# EAGLE schematic final_schematic (EAGLE 9.3.0)
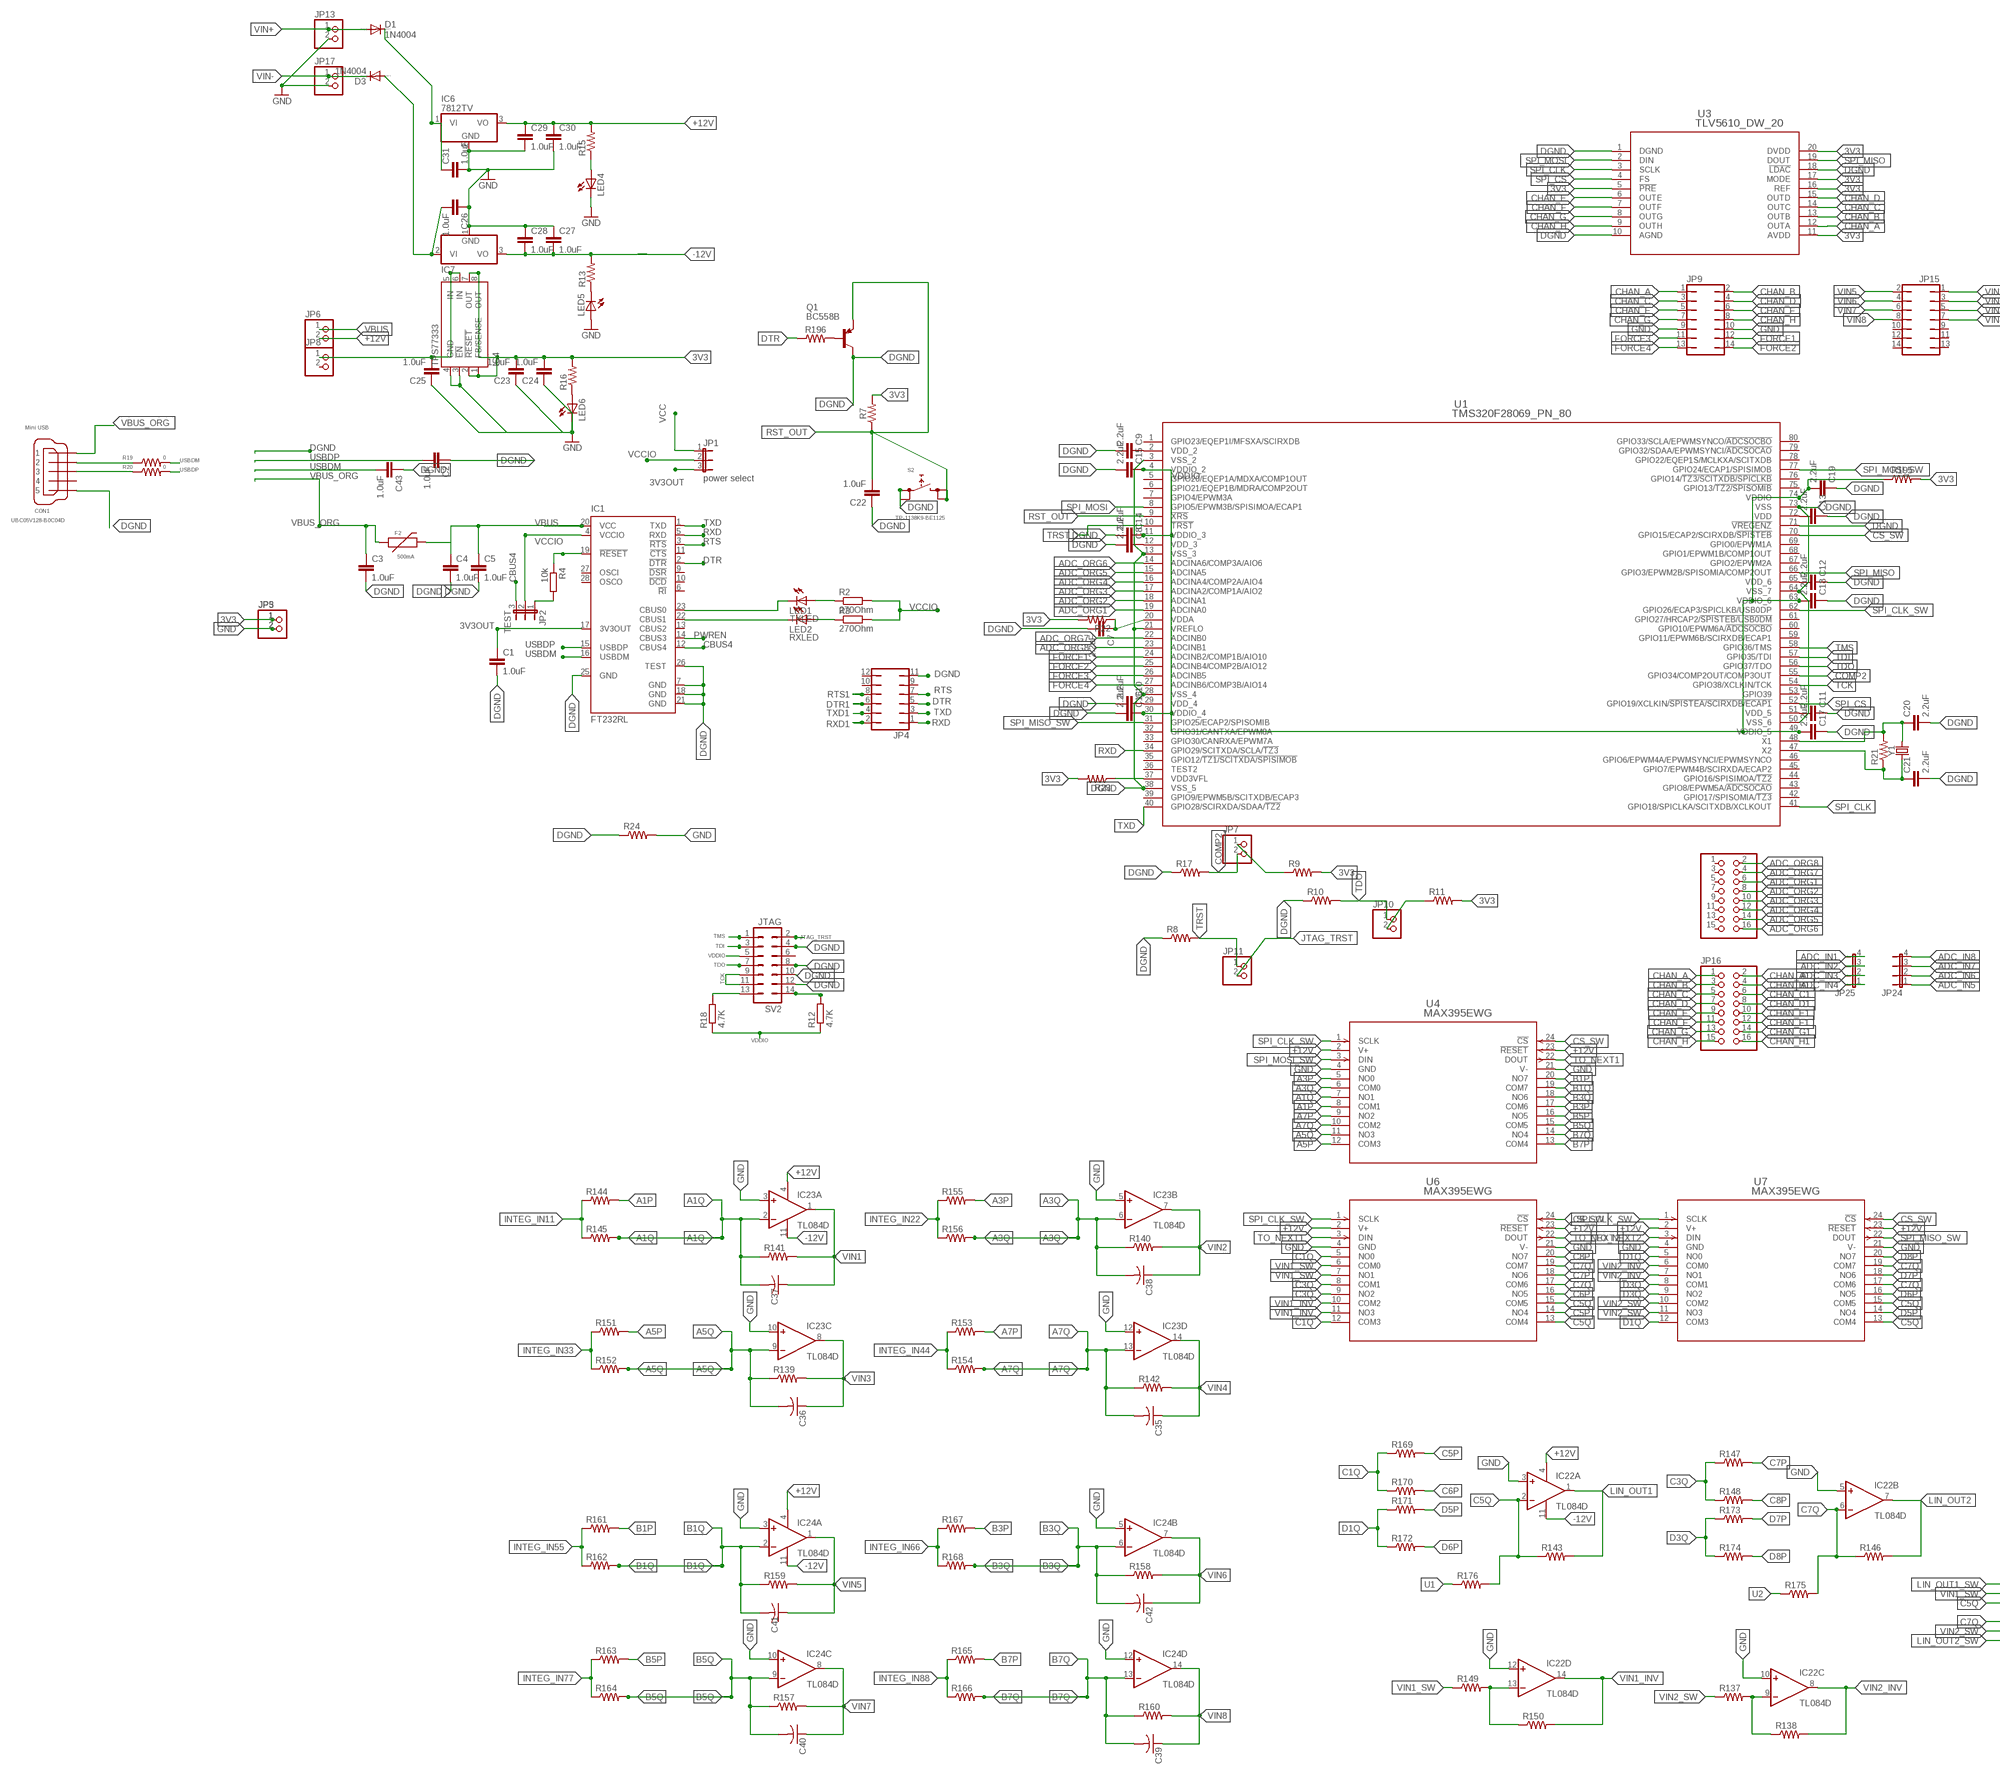
[diagram p0: schematic, sheet 1, part 1 of 3]
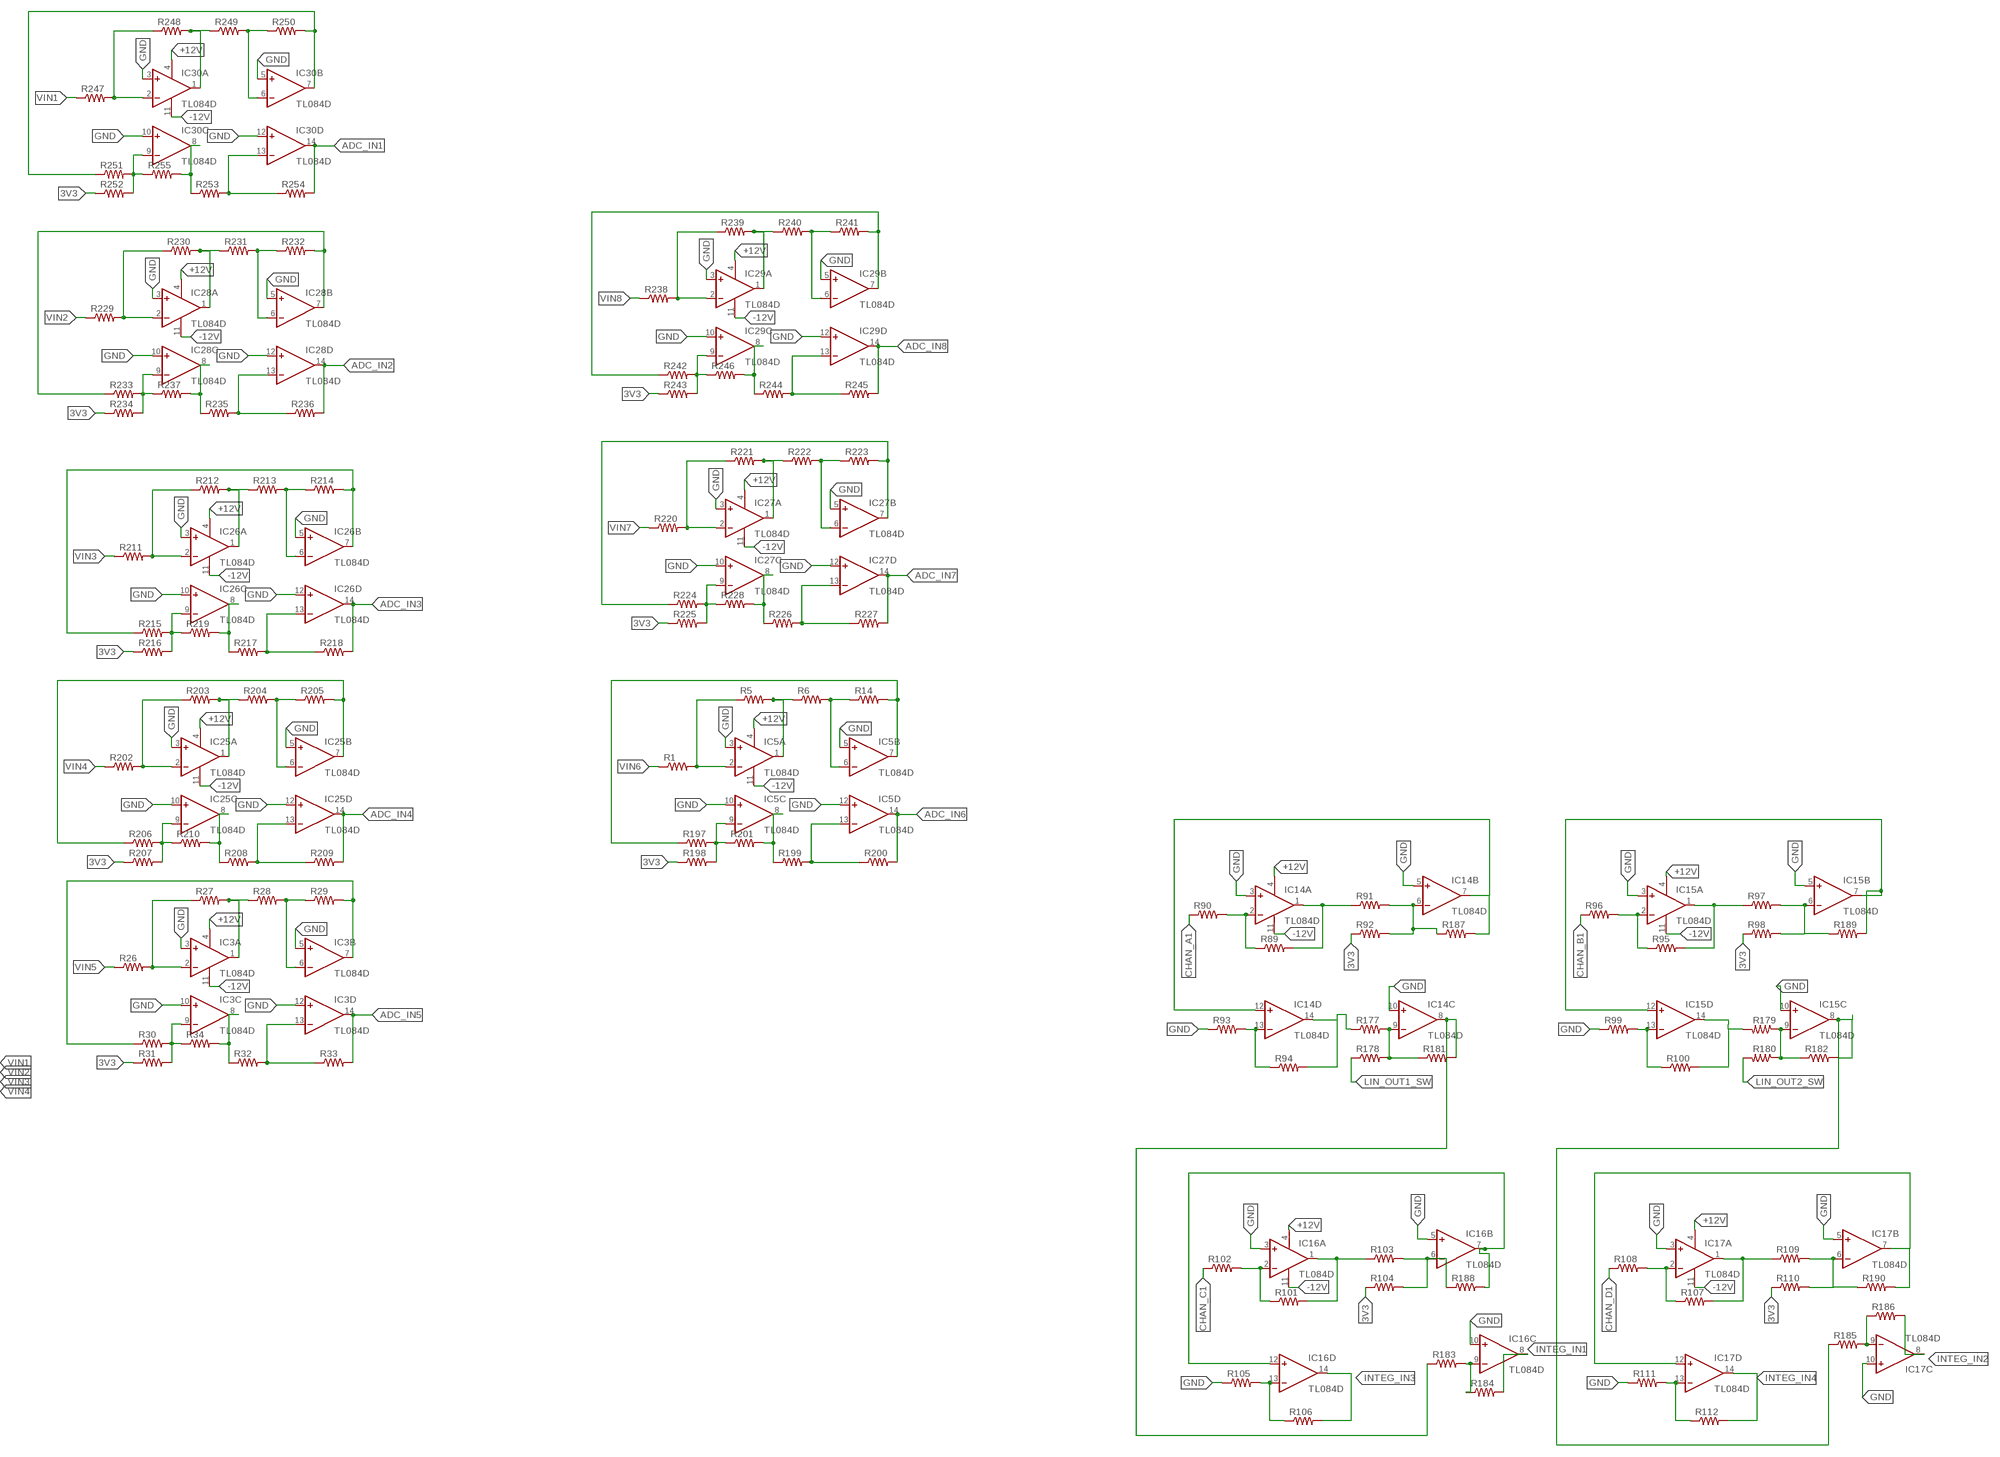
[diagram p1: schematic, sheet 1, part 2 of 3]
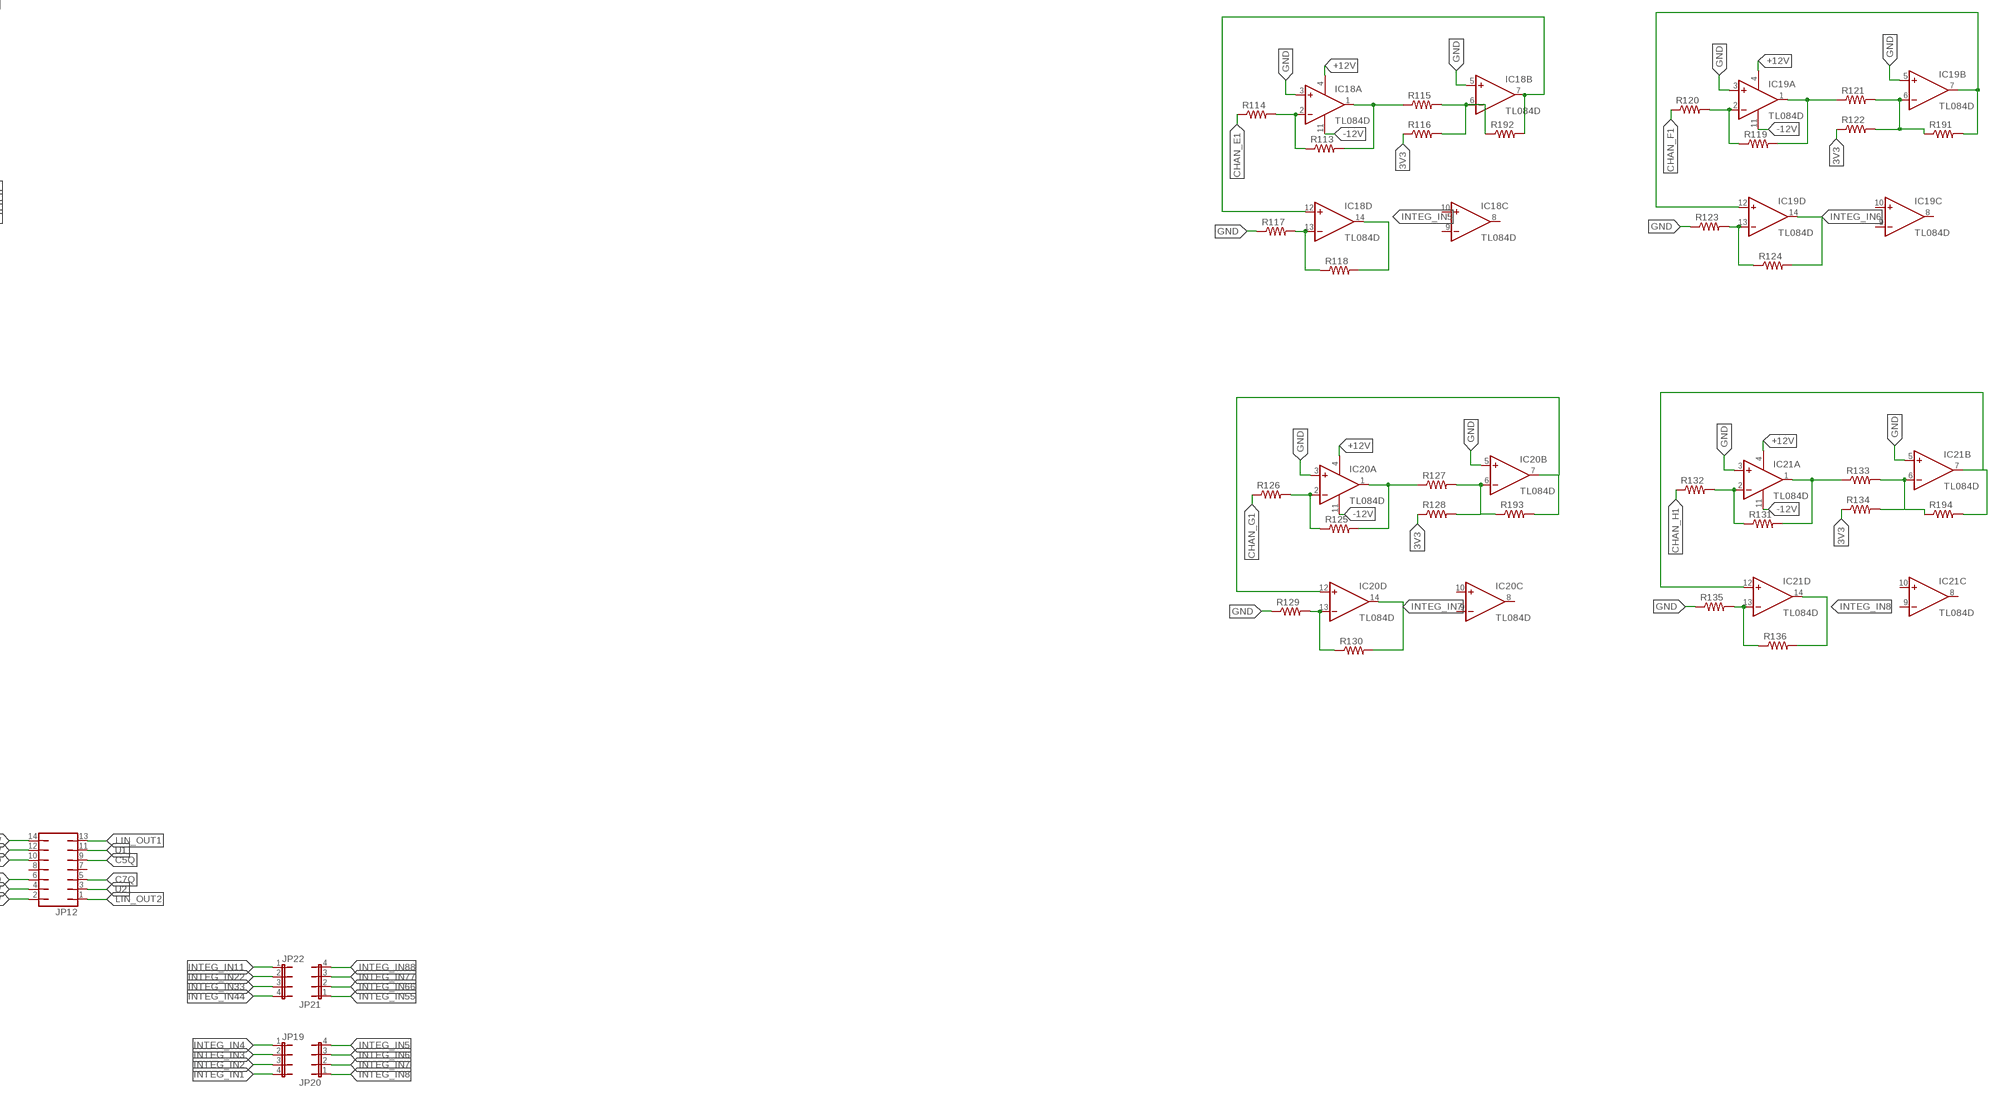
[diagram p2: schematic, sheet 1, part 3 of 3]

## Parts
C1  1.0uF  1.0UF-1206-50V-10%  [1206]
C2  1.0uF  1.0UF-1206-50V-10%  [1206]
C3  1.0uF  1.0UF-1206-50V-10%  [1206]
C4  1.0uF  1.0UF-1206-50V-10%  [1206]
C5  1.0uF  1.0UF-1206-50V-10%  [1206]
C7  2.2uF  2.2UF-1206-50V-10%  [1206]
C8  2.2uF  2.2UF-1206-50V-10%  [1206]
C9  2.2uF  2.2UF-1206-50V-10%  [1206]
C10  2.2uF  2.2UF-1206-50V-10%  [1206]
C11  2.2uF  2.2UF-1206-50V-10%  [1206]
C12  2.2uF  2.2UF-1206-50V-10%  [1206]
C13  2.2uF  2.2UF-1206-50V-10%  [1206]
C14  2.2uF  2.2UF-1206-50V-10%  [1206]
C15  2.2uF  2.2UF-1206-50V-10%  [1206]
C16  2.2uF  2.2UF-1206-50V-10%  [1206]
C17  2.2uF  2.2UF-1206-50V-10%  [1206]
C18  2.2uF  2.2UF-1206-50V-10%  [1206]
C19  2.2uF  2.2UF-1206-50V-10%  [1206]
C20  2.2uF  2.2UF-1206-50V-10%  [1206]
C21  2.2uF  2.2UF-1206-50V-10%  [1206]
C22  1.0uF  1.0UF-1206-50V-10%  [1206]
C23  1.0uF  1.0UF-1206-50V-10%  [1206]
C24  1.0uF  1.0UF-1206-50V-10%  [1206]
C25  1.0uF  1.0UF-1206-50V-10%  [1206]
C26  1.0uF  1.0UF-1206-50V-10%  [1206]
C27  1.0uF  1.0UF-1206-50V-10%  [1206]
C28  1.0uF  1.0UF-1206-50V-10%  [1206]
C29  1.0uF  1.0UF-1206-50V-10%  [1206]
C30  1.0uF  1.0UF-1206-50V-10%  [1206]
C31  1.0uF  1.0UF-1206-50V-10%  [1206]
C35  C-USC1206  [C1206]
C36  C-USC1206  [C1206]
C37  C-USC1206  [C1206]
C38  C-USC1206  [C1206]
C39  C-USC1206  [C1206]
C40  C-USC1206  [C1206]
C41  C-USC1206  [C1206]
C42  C-USC1206  [C1206]
C43  1.0uF  1.0UF-1206-50V-10%  [1206]
CON1  UBC05V128-B0C04D  MINI-USB-32005-201  [32005-201]
D1  1N4004  [DO41-10]
D3  1N4004  [DO41-10]
F2  500mA  PTCSMD  [PTC-1206]
IC1  FT232RL  [SSOP28]
IC3  TL084D  [SO14]
IC4  TPS77333  [DGK_S-PDSO-G8]
IC5  TL084D  [SO14]
IC6  7812TV  [TO220V]
IC7  7912T  [TO220H]
IC14  TL084D  [SO14]
IC15  TL084D  [SO14]
IC16  TL084D  [SO14]
IC17  TL084D  [SO14]
IC18  TL084D  [SO14]
IC19  TL084D  [SO14]
IC20  TL084D  [SO14]
IC21  TL084D  [SO14]
IC22  TL084D  [SO14]
IC23  TL084D  [SO14]
IC24  TL084D  [SO14]
IC25  TL084D  [SO14]
IC26  TL084D  [SO14]
IC27  TL084D  [SO14]
IC28  TL084D  [SO14]
IC29  TL084D  [SO14]
IC30  TL084D  [SO14]
JP1  power select  JP2E  [JP2]
JP2  TEST  JP2E  [JP2]
JP3  PINHD-1X2  [1X02]
JP4  JP6Q  [JP6Q]
JP5  PINHD-1X2  [1X02]
JP6  PINHD-1X2  [1X02]
JP7  PINHD-1X2  [1X02]
JP8  PINHD-1X2  [1X02]
JP9  JP7Q  [JP7Q]
JP10  PINHD-1X2  [1X02]
JP11  PINHD-1X2  [1X02]
JP12  JP7Q  [JP7Q]
JP13  PINHD-1X2  [1X02]
JP15  JP7Q  [JP7Q]
JP16  PINHD-2X8  [2X08]
JP17  PINHD-1X2  [1X02]
JP18  PINHD-2X8  [2X08]
JP19  JP4E  [JP4]
JP20  JP4E  [JP4]
JP21  JP4E  [JP4]
JP22  JP4E  [JP4]
JP24  JP4E  [JP4]
JP25  JP4E  [JP4]
LED1  TXLED  LEDCHIPLED_1206  [CHIPLED_1206]
LED2  RXLED  LEDCHIPLED_1206  [CHIPLED_1206]
LED4  LED3MM  [LED3MM]
LED5  LED3MM  [LED3MM]
LED6  LED3MM  [LED3MM]
Q1  BC558B  [TO92-EBC]
R1  R-US_R1206  [R1206]
R2  270Ohm  R-EU_M1206  [M1206]
R3  270Ohm  R-EU_M1206  [M1206]
R4  10k  R-EU_M1206  [M1206]
R5  R-US_R1206  [R1206]
R6  R-US_R1206  [R1206]
R7  RESISTOR1206  [1206]
R8  R-US_R1206  [R1206]
R9  R-US_R1206  [R1206]
R10  R-US_R1206  [R1206]
R11  R-US_R1206  [R1206]
R12  4.7K  R-EU_M1206  [M1206]
R13  R-US_R1206  [R1206]
R14  R-US_R1206  [R1206]
R15  R-US_R1206  [R1206]
R16  R-US_R1206  [R1206]
R17  R-US_R1206  [R1206]
R18  4.7K  R-EU_M1206  [M1206]
R19  0  R-US_R1206  [R1206]
R20  0  R-US_R1206W  [R1206W]
R21  R-US_R1206  [R1206]
R22  R-US_R1206  [R1206]
R23  R-US_R1206  [R1206]
R24  R-US_0207/7  [0207/7]
R26  R-US_R1206  [R1206]
R27  R-US_R1206  [R1206]
R28  R-US_R1206  [R1206]
R29  R-US_R1206  [R1206]
R30  R-US_R1206  [R1206]
R31  R-US_R1206  [R1206]
R32  R-US_R1206  [R1206]
R33  R-US_R1206  [R1206]
R34  R-US_R1206  [R1206]
R89  R-US_R1206  [R1206]
R90  R-US_R1206  [R1206]
R91  R-US_R1206  [R1206]
R92  R-US_R1206  [R1206]
R93  R-US_R1206  [R1206]
R94  R-US_R1206  [R1206]
R95  R-US_R1206  [R1206]
R96  R-US_R1206  [R1206]
R97  R-US_R1206  [R1206]
R98  R-US_R1206  [R1206]
R99  R-US_R1206  [R1206]
R100  R-US_R1206  [R1206]
R101  R-US_R1206  [R1206]
R102  R-US_R1206  [R1206]
R103  R-US_R1206  [R1206]
R104  R-US_R1206  [R1206]
R105  R-US_R1206  [R1206]
R106  R-US_R1206  [R1206]
R107  R-US_R1206  [R1206]
R108  R-US_R1206  [R1206]
R109  R-US_R1206  [R1206]
R110  R-US_R1206  [R1206]
R111  R-US_R1206  [R1206]
R112  R-US_R1206  [R1206]
R113  R-US_R1206  [R1206]
R114  R-US_R1206  [R1206]
R115  R-US_R1206  [R1206]
R116  R-US_R1206  [R1206]
R117  R-US_R1206  [R1206]
R118  R-US_R1206  [R1206]
R119  R-US_R1206  [R1206]
R120  R-US_R1206  [R1206]
R121  R-US_R1206  [R1206]
R122  R-US_R1206  [R1206]
R123  R-US_R1206  [R1206]
R124  R-US_R1206  [R1206]
R125  R-US_R1206  [R1206]
R126  R-US_R1206  [R1206]
R127  R-US_R1206  [R1206]
R128  R-US_R1206  [R1206]
R129  R-US_R1206  [R1206]
R130  R-US_R1206  [R1206]
R131  R-US_R1206  [R1206]
R132  R-US_R1206  [R1206]
R133  R-US_R1206  [R1206]
R134  R-US_R1206  [R1206]
R135  R-US_R1206  [R1206]
R136  R-US_R1206  [R1206]
R137  R-US_R1206  [R1206]
R138  R-US_R1206  [R1206]
R139  R-US_R1206  [R1206]
R140  R-US_R1206  [R1206]
R141  R-US_R1206  [R1206]
R142  R-US_R1206  [R1206]
R143  R-US_R1206  [R1206]
R144  R-US_R1206  [R1206]
R145  R-US_R1206  [R1206]
R146  R-US_R1206  [R1206]
R147  R-US_R1206  [R1206]
R148  R-US_R1206  [R1206]
R149  R-US_R1206  [R1206]
R150  R-US_R1206  [R1206]
R151  R-US_R1206  [R1206]
R152  R-US_R1206  [R1206]
R153  R-US_R1206  [R1206]
R154  R-US_R1206  [R1206]
R155  R-US_R1206  [R1206]
R156  R-US_R1206  [R1206]
R157  R-US_R1206  [R1206]
R158  R-US_R1206  [R1206]
R159  R-US_R1206  [R1206]
R160  R-US_R1206  [R1206]
R161  R-US_R1206  [R1206]
R162  R-US_R1206  [R1206]
R163  R-US_R1206  [R1206]
R164  R-US_R1206  [R1206]
R165  R-US_R1206  [R1206]
R166  R-US_R1206  [R1206]
R167  R-US_R1206  [R1206]
R168  R-US_R1206  [R1206]
R169  R-US_R1206  [R1206]
R170  R-US_R1206  [R1206]
R171  R-US_R1206  [R1206]
R172  R-US_R1206  [R1206]
R173  R-US_R1206  [R1206]
R174  R-US_R1206  [R1206]
R175  R-US_R1206  [R1206]
R176  R-US_R1206  [R1206]
R177  R-US_R1206  [R1206]
R178  R-US_R1206  [R1206]
R179  R-US_R1206  [R1206]
R180  R-US_R1206  [R1206]
R181  R-US_R1206  [R1206]
R182  R-US_R1206  [R1206]
R183  R-US_R1206  [R1206]
R184  R-US_R1206  [R1206]
R185  R-US_R1206  [R1206]
R186  R-US_R1206  [R1206]
R187  R-US_R1206  [R1206]
R188  R-US_R1206  [R1206]
R189  R-US_R1206  [R1206]
R190  R-US_R1206  [R1206]
R191  R-US_R1206  [R1206]
R192  R-US_R1206  [R1206]
R193  R-US_R1206  [R1206]
R194  R-US_R1206  [R1206]
R195  RESISTOR1206  [1206]
R196  RESISTOR1206  [1206]
R197  R-US_R1206  [R1206]
R198  R-US_R1206  [R1206]
R199  R-US_R1206  [R1206]
R200  R-US_R1206  [R1206]
R201  R-US_R1206  [R1206]
R202  R-US_R1206  [R1206]
R203  R-US_R1206  [R1206]
R204  R-US_R1206  [R1206]
R205  R-US_R1206  [R1206]
R206  R-US_R1206  [R1206]
R207  R-US_R1206  [R1206]
R208  R-US_R1206  [R1206]
R209  R-US_R1206  [R1206]
R210  R-US_R1206  [R1206]
R211  R-US_R1206  [R1206]
R212  R-US_R1206  [R1206]
R213  R-US_R1206  [R1206]
R214  R-US_R1206  [R1206]
R215  R-US_R1206  [R1206]
R216  R-US_R1206  [R1206]
R217  R-US_R1206  [R1206]
R218  R-US_R1206  [R1206]
R219  R-US_R1206  [R1206]
R220  R-US_R1206  [R1206]
R221  R-US_R1206  [R1206]
R222  R-US_R1206  [R1206]
R223  R-US_R1206  [R1206]
R224  R-US_R1206  [R1206]
R225  R-US_R1206  [R1206]
R226  R-US_R1206  [R1206]
R227  R-US_R1206  [R1206]
R228  R-US_R1206  [R1206]
R229  R-US_R1206  [R1206]
R230  R-US_R1206  [R1206]
R231  R-US_R1206  [R1206]
R232  R-US_R1206  [R1206]
R233  R-US_R1206  [R1206]
R234  R-US_R1206  [R1206]
R235  R-US_R1206  [R1206]
R236  R-US_R1206  [R1206]
R237  R-US_R1206  [R1206]
R238  R-US_R1206  [R1206]
R239  R-US_R1206  [R1206]
R240  R-US_R1206  [R1206]
R241  R-US_R1206  [R1206]
R242  R-US_R1206  [R1206]
R243  R-US_R1206  [R1206]
R244  R-US_R1206  [R1206]
R245  R-US_R1206  [R1206]
R246  R-US_R1206  [R1206]
R247  R-US_R1206  [R1206]
R248  R-US_R1206  [R1206]
R249  R-US_R1206  [R1206]
R250  R-US_R1206  [R1206]
R251  R-US_R1206  [R1206]
R252  R-US_R1206  [R1206]
R253  R-US_R1206  [R1206]
R254  R-US_R1206  [R1206]
R255  R-US_R1206  [R1206]
S2  TP-1138K9-BE1125  FSMJSMA  [FSMJSMA]
SV2  JTAG  MA07-2  [MA07-2]
U1  TMS320F28069_PN_80  [PN80]
U3  TLV5610_DW_20  [DW20]
U4  MAX395EWG  [21-0042B_24]
U6  MAX395EWG  [21-0042B_24]
U7  MAX395EWG  [21-0042B_24]
Y1  CRYSTALPTH-HC49UV  [HC49U]

## Nets
3V3: C23.2 C24.2 IC4.1(FB/SENSE) IC4.2(!RESET) IC4.7(OUT) IC4.8(OUT) JP3.1 JP5.1 R7.2 R9.2 R11.2 R16.2 R22.2 R23.2 R31.1 R92.1 R98.1 R104.1 R110.1 R116.1 R122.1 R128.1 R134.1 R195.2 R198.1 R207.1 R216.1 R225.1 R234.1 R243.1 R252.1 U3.5(!PRE) U3.11(AVDD) U3.16(REF) U3.17(MODE) U3.20(DVDD)
3V3OUT: C1.1 IC1.17(3V3OUT) JP1.3
+12V: C29.1 C30.1 IC3.4(P:V+) IC5.4(P:V+) IC6.3(VO) IC14.4(P:V+) IC15.4(P:V+) IC16.4(P:V+) IC17.4(P:V+) IC18.4(P:V+) IC19.4(P:V+) IC20.4(P:V+) IC21.4(P:V+) IC22.4(P:V+) IC23.4(P:V+) IC24.4(P:V+) IC25.4(P:V+) IC26.4(P:V+) IC27.4(P:V+) IC28.4(P:V+) IC29.4(P:V+) IC30.4(P:V+) JP6.2 R15.2 U4.2(V+) U4.23(!RESET) U6.2(V+) U6.23(!RESET) U7.2(V+) U7.23(!RESET)
-12V: C27.2 C28.2 IC3.11(P:V-) IC5.11(P:V-) IC7.3(VO) IC14.11(P:V-) IC15.11(P:V-) IC16.11(P:V-) IC17.11(P:V-) IC18.11(P:V-) IC19.11(P:V-) IC20.11(P:V-) IC21.11(P:V-) IC22.11(P:V-) IC23.11(P:V-) IC24.11(P:V-) IC25.11(P:V-) IC26.11(P:V-) IC27.11(P:V-) IC28.11(P:V-) IC29.11(P:V-) IC30.11(P:V-) R13.2
A1P: R144.2 U4.8(COM1)
A1Q: C37.2 IC23.2(A:-IN) R141.1 R145.2 U4.7(NO1)
A3P: R155.2 U4.5(NO0)
A3Q: C38.2 IC23.6(B:-IN) R140.1 R156.2 U4.6(COM0)
A5P: R151.2 U4.12(COM3)
A5Q: C36.2 IC23.9(C:-IN) R139.1 R152.2 U4.11(NO3)
A7P: R153.2 U4.9(NO2)
A7Q: C35.2 IC23.13(D:-IN) R142.1 R154.2 U4.10(COM2)
ADC_IN1: IC30.14(D:OUT) JP25.4 R254.2
ADC_IN2: IC28.14(D:OUT) JP25.3 R236.2
ADC_IN3: IC26.14(D:OUT) JP25.2 R218.2
ADC_IN4: IC25.14(D:OUT) JP25.1 R209.2
ADC_IN5: IC3.14(D:OUT) JP24.1 R33.2
ADC_IN6: IC5.14(D:OUT) JP24.2 R200.2
ADC_IN7: IC27.14(D:OUT) JP24.3 R227.2
ADC_IN8: IC29.14(D:OUT) JP24.4 R245.2
ADC_ORG1: JP18.6 U1.19(ADCINA0)
ADC_ORG2: JP18.8 U1.18(ADCINA1)
ADC_ORG3: JP18.10 U1.17(ADCINA2/COMP1A/AIO2)
ADC_ORG4: JP18.12 U1.16(ADCINA4/COMP2A/AIO4)
ADC_ORG5: JP18.14 U1.15(ADCINA5)
ADC_ORG6: JP18.16 U1.14(ADCINA6/COMP3A/AIO6)
ADC_ORG7: JP18.4 U1.22(ADCINB0)
ADC_ORG8: JP18.2 U1.23(ADCINB1)
B1P: R161.2 U4.20(NO7)
B1Q: C41.2 IC24.2(A:-IN) R159.1 R162.2 U4.19(COM7)
B3P: R167.2 U4.17(COM6)
B3Q: C42.2 IC24.6(B:-IN) R158.1 R168.2 U4.18(NO6)
B5P: R163.2 U4.16(NO5)
B5Q: C40.2 IC24.9(C:-IN) R157.1 R164.2 U4.15(COM5)
B7P: R165.2 U4.13(COM4)
B7Q: C39.2 IC24.13(D:-IN) R160.1 R166.2 U4.14(NO4)
C1Q: R169.1 R170.1 U6.5(NO0) U6.12(COM3)
C3Q: R147.1 R148.1 U6.8(COM1) U6.9(NO2)
C5P: R169.2 U6.14(NO4)
C5Q: IC22.2(A:-IN) JP12.9 JP12.10 R143.1 R176.2 U6.13(COM4) U6.15(COM5) U7.13(COM4) U7.15(COM5)
C6P: R170.2 U6.16(NO5)
C7P: R147.2 U6.18(NO6)
C7Q: IC22.6(B:-IN) JP12.5 JP12.6 R146.1 R175.2 U6.17(COM6) U6.19(COM7) U7.17(COM6) U7.19(COM7)
C8P: R148.2 U6.20(NO7)
CBUS4: IC1.12(CBUS4) JP2.3
CHAN_A: JP9.1 JP16.1 U3.12(OUTA)
CHAN_A1: JP16.2 R90.1
CHAN_B: JP9.2 JP16.3 U3.13(OUTB)
CHAN_B1: JP16.4 R96.1
CHAN_C: JP9.3 JP16.5 U3.14(OUTC)
CHAN_C1: JP16.6 R102.1
CHAN_D: JP9.4 JP16.7 U3.15(OUTD)
CHAN_D1: JP16.8 R108.1
CHAN_E: JP9.5 JP16.9 U3.6(OUTE)
CHAN_E1: JP16.10 R114.1
CHAN_F: JP9.6 JP16.11 U3.7(OUTF)
CHAN_F1: JP16.12 R120.1
CHAN_G: JP9.7 JP16.13 U3.8(OUTG)
CHAN_G1: JP16.14 R126.1
CHAN_H: JP9.8 JP16.15 U3.9(OUTH)
CHAN_H1: JP16.16 R132.1
COMP2: JP7.2 R17.2 U1.55(GPIO34/COMP2OUT/COMP3OUT)
CS_SW: U1.70(GPIO15/ECAP2/SCIRXDB/!SPISTEB) U4.24(!CS) U6.24(!CS) U7.24(!CS)
D1Q: R171.1 R172.1 U7.5(NO0) U7.12(COM3)
D3Q: R173.1 R174.1 U7.8(COM1) U7.9(NO2)
D5P: R171.2 U7.14(NO4)
D6P: R172.2 U7.16(NO5)
D7P: R173.2 U7.18(NO6)
D8P: R174.2 U7.20(NO7)
DGND [power]: C1.2 C2.1 C3.2 C4.2 C5.2 C7.2 C8.2 C9.2 C10.2 C11.1 C12.1 C13.1 C14.2 C15.2 C16.2 C17.1 C18.1 C19.1 C20.2 C21.2 C22.1 C43.1 CON1.5 IC1.7(GND) IC1.18(GND) IC1.21(GND) IC1.25(GND) IC1.26(TEST) JP4.11 Q1.C R8.1 R10.1 R17.1 R24.1 S2.P$1 S2.P$2 SV2.4 SV2.8 SV2.10 SV2.12 U1.3(VSS_2) U1.13(VSS_3) U1.21(VREFLO) U1.28(VSS_4) U1.38(VSS_5) U1.50(VSS_6) U1.64(VSS_7) U1.71(!VREGENZ) U1.73(VSS) U3.1(DGND) U3.10(AGND) U3.18(!LDAC)
DTR: IC1.2(!DTR) JP4.5 R196.1
DTR1: JP4.6
FORCE1: JP9.12 U1.24(ADCINB2/COMP1B/AIO10)
FORCE2: JP9.14 U1.25(ADCINB4/COMP2B/AIO12)
FORCE3: JP9.11 U1.26(ADCINB5)
FORCE4: JP9.13 U1.27(ADCINB6/COMP3B/AIO14)
GND [power]: C23.1 C24.1 C25.1 C26.1 C27.1 C28.1 C29.2 C30.2 C31.2 IC3.3(A:+IN) IC3.5(B:+IN) IC3.10(C:+IN) IC3.12(D:+IN) IC4.3(!EN) IC4.4(GND) IC5.3(A:+IN) IC5.5(B:+IN) IC5.10(C:+IN) IC5.12(D:+IN) IC6.2(GND) IC7.1(GND) IC14.3(A:+IN) IC14.5(B:+IN) IC14.10(C:+IN) IC15.3(A:+IN) IC15.5(B:+IN) IC15.10(C:+IN) IC16.3(A:+IN) IC16.5(B:+IN) IC16.10(C:+IN) IC17.3(A:+IN) IC17.5(B:+IN) IC17.10(C:+IN) IC18.3(A:+IN) IC18.5(B:+IN) IC19.3(A:+IN) IC19.5(B:+IN) IC20.3(A:+IN) IC20.5(B:+IN) IC21.3(A:+IN) IC21.5(B:+IN) IC22.3(A:+IN) IC22.5(B:+IN) IC22.10(C:+IN) IC22.12(D:+IN) IC23.3(A:+IN) IC23.5(B:+IN) IC23.10(C:+IN) IC23.12(D:+IN) IC24.3(A:+IN) IC24.5(B:+IN) IC24.10(C:+IN) IC24.12(D:+IN) IC25.3(A:+IN) IC25.5(B:+IN) IC25.10(C:+IN) IC25.12(D:+IN) IC26.3(A:+IN) IC26.5(B:+IN) IC26.10(C:+IN) IC26.12(D:+IN) IC27.3(A:+IN) IC27.5(B:+IN) IC27.10(C:+IN) IC27.12(D:+IN) IC28.3(A:+IN) IC28.5(B:+IN) IC28.10(C:+IN) IC28.12(D:+IN) IC29.3(A:+IN) IC29.5(B:+IN) IC29.10(C:+IN) IC29.12(D:+IN) IC30.3(A:+IN) IC30.5(B:+IN) IC30.10(C:+IN) IC30.12(D:+IN) JP3.2 JP5.2 JP9.9 JP9.10 JP13.2 JP17.2 LED4.K(C) LED5.A LED6.K(C) R24.2 R93.1 R99.1 R105.1 R111.1 R117.1 R123.1 R129.1 R135.1 U4.4(GND) U4.21(V-) U6.4(GND) U6.21(V-) U7.4(GND) U7.21(V-)
INTEG_IN1: IC16.8(C:OUT) JP19.4 R184.2
INTEG_IN2: IC17.8(C:OUT) JP19.3 R186.2
INTEG_IN3: IC16.14(D:OUT) JP19.2 R106.2
INTEG_IN4: IC17.14(D:OUT) JP19.1 R112.2
INTEG_IN5: IC18.14(D:OUT) JP20.4 R118.2
INTEG_IN6: IC19.14(D:OUT) JP20.3 R124.2
INTEG_IN7: IC20.14(D:OUT) JP20.2 R130.2
INTEG_IN8: IC21.14(D:OUT) JP20.1 R136.2
INTEG_IN11: JP22.1 R144.1 R145.1
INTEG_IN22: JP22.2 R155.1 R156.1
INTEG_IN33: JP22.3 R151.1 R152.1
INTEG_IN44: JP22.4 R153.1 R154.1
INTEG_IN55: JP21.1 R161.1 R162.1
INTEG_IN66: JP21.2 R167.1 R168.1
INTEG_IN77: JP21.3 R163.1 R164.1
INTEG_IN88: JP21.4 R165.1 R166.1
JTAG_TRST: JP11.2 SV2.2
LIN_OUT1: IC22.1(A:OUT) JP12.13 R143.2
LIN_OUT1_SW: JP12.14 R178.1
LIN_OUT2: IC22.7(B:OUT) JP12.1 R146.2
LIN_OUT2_SW: JP12.2 R180.2
N$1: C7.1 R22.1 U1.20(VDDA)
N$2: C8.1 U1.12(VDD_3)
N$3: C9.1 U1.2(VDD_2)
N$4: LED1.A R2.1
N$5: C10.1 U1.29(VDD_4)
N$6: C11.2 U1.51(VDD_5)
N$7: C12.2 U1.65(VDD_6)
N$8: C13.2 U1.72(VDD)
N$9: LED2.A R3.1
N$10: IC1.23(CBUS0) LED1.C
N$11: IC1.22(CBUS1) LED2.C
N$12: CON1.2 R19.1
N$13: CON1.3 R20.1
N$14: JP2.1 R4.2
N$15: C20.1 R21.2 U1.48(X1) Y1.2
N$16: R23.1 U1.37(VDD3VFL)
N$18: C21.1 R21.1 U1.47(X2) Y1.1
N$19: JP7.1 R9.1
N$20: Q1.B R196.2
N$21: JP10.2 R11.1
N$22: R18.2 SV2.13
N$23: C26.2 D3.A IC7.2(VI)
N$24: R12.2 SV2.14
N$26: C25.2 IC4.5(IN) IC4.6(IN) JP8.1
N$28: LED4.A R15.1
N$30: C31.1 D1.C IC6.1(VI)
N$31: IC14.2(A:-IN) R89.1 R90.2
N$32: LED5.K(C) R13.1
N$33: LED6.A R16.1
N$36: IC3.2(A:-IN) R26.2 R27.1
N$37: IC3.1(A:OUT) R27.2 R28.1
N$38: IC3.6(B:-IN) R28.2 R29.1
N$39: IC5.2(A:-IN) R1.2 R5.1
N$40: IC3.8(C:OUT) R32.1 R34.2
N$41: IC14.1(A:OUT) R89.2 R91.1
N$42: IC3.13(D:-IN) R32.2 R33.1
N$43: IC3.9(C:-IN) R30.2 R31.2 R34.1
N$49: IC14.6(B:-IN) R91.2 R92.2 R187.1
N$57: IC14.13(D:-IN) R93.2 R94.1
N$65: IC14.8(C:OUT) R181.2 R183.1
N$73: IC14.7(B:OUT) IC14.12(D:+IN) R187.2
N$81: IC15.2(A:-IN) R95.1 R96.2
N$89: IC15.1(A:OUT) R95.2 R97.1
N$92: IC15.6(B:-IN) R97.2 R98.2 R189.1
N$93: IC15.13(D:-IN) R99.2 R100.1
N$94: IC15.14(D:OUT) R100.2 R179.2
N$95: IC15.7(B:OUT) IC15.12(D:+IN) R189.2
N$96: IC16.2(A:-IN) R101.1 R102.2
N$97: IC16.1(A:OUT) R101.2 R103.1
N$98: IC16.6(B:-IN) R103.2 R104.2 R188.1
N$99: IC16.13(D:-IN) R105.2 R106.1
N$100: IC14.9(C:-IN) R177.2 R178.2 R181.1
N$101: IC16.7(B:OUT) IC16.12(D:+IN) R188.2
N$102: IC17.2(A:-IN) R107.1 R108.2
N$103: IC17.1(A:OUT) R107.2 R109.1
N$104: IC17.6(B:-IN) R109.2 R110.2 R190.1
N$105: IC17.13(D:-IN) R111.2 R112.1
N$106: IC15.9(C:-IN) R179.1 R180.1 R182.1
N$107: IC17.7(B:OUT) IC17.12(D:+IN) R190.2
N$108: IC18.2(A:-IN) R113.1 R114.2
N$109: IC18.1(A:OUT) R113.2 R115.1
N$110: IC18.6(B:-IN) R115.2 R116.2 R192.1
N$111: IC18.13(D:-IN) R117.2 R118.1
N$112: IC14.14(D:OUT) R94.2 R177.1
N$113: IC18.7(B:OUT) IC18.12(D:+IN) R192.2
N$114: IC19.2(A:-IN) R119.1 R120.2
N$115: IC19.1(A:OUT) R119.2 R121.1
N$116: IC19.6(B:-IN) R121.2 R122.2 R191.1
N$117: IC19.13(D:-IN) R123.2 R124.1
N$118: IC15.8(C:OUT) R182.2 R185.1
N$119: IC19.7(B:OUT) IC19.12(D:+IN) R191.2
N$120: IC20.2(A:-IN) R125.1 R126.2
N$121: IC20.1(A:OUT) R125.2 R127.1
N$122: IC20.6(B:-IN) R127.2 R128.2 R193.1
N$123: IC20.13(D:-IN) R129.2 R130.1
N$124: IC17.9(C:-IN) R185.2 R186.1
N$125: IC20.7(B:OUT) IC20.12(D:+IN) R193.2
N$126: IC21.2(A:-IN) R131.1 R132.2
N$127: IC21.1(A:OUT) R131.2 R133.1
N$128: IC21.6(B:-IN) R133.2 R134.2 R194.1
N$129: IC21.13(D:-IN) R135.2 R136.1
N$130: IC16.9(C:-IN) R183.2 R184.1
N$131: IC21.7(B:OUT) IC21.12(D:+IN) R194.2
N$132: IC22.13(D:-IN) R149.2 R150.1
N$133: IC22.9(C:-IN) R137.2 R138.1
N$134: IC5.1(A:OUT) R5.2 R6.1
N$135: IC3.7(B:OUT) R29.2 R30.1
N$137: IC5.6(B:-IN) R6.2 R14.1
N$138: IC5.8(C:OUT) R199.1 R201.2
N$139: IC5.13(D:-IN) R199.2 R200.1
N$140: IC5.9(C:-IN) R197.2 R198.2 R201.1
N$141: IC5.7(B:OUT) R14.2 R197.1
N$142: IC25.2(A:-IN) R202.2 R203.1
N$143: IC25.1(A:OUT) R203.2 R204.1
N$144: IC25.6(B:-IN) R204.2 R205.1
N$145: IC25.8(C:OUT) R208.1 R210.2
N$146: IC25.13(D:-IN) R208.2 R209.1
N$147: IC25.9(C:-IN) R206.2 R207.2 R210.1
N$148: IC25.7(B:OUT) R205.2 R206.1
N$149: IC26.2(A:-IN) R211.2 R212.1
N$150: IC26.1(A:OUT) R212.2 R213.1
N$151: IC26.6(B:-IN) R213.2 R214.1
N$152: IC26.8(C:OUT) R217.1 R219.2
N$153: IC26.13(D:-IN) R217.2 R218.1
N$154: IC26.9(C:-IN) R215.2 R216.2 R219.1
N$155: IC26.7(B:OUT) R214.2 R215.1
N$156: IC27.2(A:-IN) R220.2 R221.1
N$157: IC27.1(A:OUT) R221.2 R222.1
N$158: IC27.6(B:-IN) R222.2 R223.1
N$159: IC27.8(C:OUT) R226.1 R228.2
N$160: IC27.13(D:-IN) R226.2 R227.1
N$161: IC27.9(C:-IN) R224.2 R225.2 R228.1
N$162: IC27.7(B:OUT) R223.2 R224.1
N$163: IC28.2(A:-IN) R229.2 R230.1
N$164: IC28.1(A:OUT) R230.2 R231.1
N$165: IC28.6(B:-IN) R231.2 R232.1
N$166: IC28.8(C:OUT) R235.1 R237.2
N$167: IC28.13(D:-IN) R235.2 R236.1
N$168: IC28.9(C:-IN) R233.2 R234.2 R237.1
N$169: IC28.7(B:OUT) R232.2 R233.1
N$170: IC29.2(A:-IN) R238.2 R239.1
N$171: IC29.1(A:OUT) R239.2 R240.1
N$172: IC29.6(B:-IN) R240.2 R241.1
N$173: IC29.8(C:OUT) R244.1 R246.2
N$174: IC29.13(D:-IN) R244.2 R245.1
N$175: IC29.9(C:-IN) R242.2 R243.2 R246.1
N$176: IC29.7(B:OUT) R241.2 R242.1
N$177: IC30.2(A:-IN) R247.2 R248.1
N$178: IC30.1(A:OUT) R248.2 R249.1
N$179: IC30.6(B:-IN) R249.2 R250.1
N$180: IC30.8(C:OUT) R253.1 R255.2
N$181: IC30.13(D:-IN) R253.2 R254.1
N$182: IC30.9(C:-IN) R251.2 R252.2 R255.1
N$183: IC30.7(B:OUT) R250.2 R251.1
PWREN: IC1.14(CBUS3)
RESET: IC1.19(!RESET) R4.1
RST_OUT: C22.2 Q1.E R7.1 S2.P$3 S2.P$4 U1.9(!XRS)
RTS: IC1.3(!RTS) JP4.7
RTS1: JP4.8
RXD: IC1.5(RXD) JP4.1 U1.34(GPIO29/SCITXDA/SCLA/!TZ3)
RXD1: JP4.2
SPI_CLK: U1.41(GPIO18/SPICLKA/SCITXDB/XCLKOUT) U3.3(SCLK)
SPI_CLK_SW: U1.62(GPIO26/ECAP3/SPICLKB/USB0DP) U4.1(SCLK) U6.1(SCLK) U7.1(SCLK)
SPI_CS: U1.52(GPIO19/XCLKIN/!SPISTEA/SCIRXDB/ECAP1) U3.4(FS)
SPI_MISO: U1.66(GPIO3/EPWM2B/SPISOMIA/COMP2OUT) U3.19(DOUT)
SPI_MISO_SW: U1.31(GPIO25/ECAP2/SPISOMIB) U7.22(DOUT)
SPI_MOSI: U1.8(GPIO5/EPWM3B/SPISIMOA/ECAP1) U3.2(DIN)
SPI_MOSI_SW: U1.77(GPIO24/ECAP1/SPISIMOB) U4.3(DIN)
TCK: SV2.9 SV2.11 U1.54(GPIO38/XCLKIN/TCK)
TDI: SV2.3 U1.57(GPIO35/TDI)
TDO: JP10.1 R10.2 SV2.7 U1.56(GPIO37/TDO)
TMS: SV2.1 U1.58(GPIO36/TMS)
TO_NEXT1: U4.22(DOUT) U6.3(DIN)
TO_NEXT2: U6.22(DOUT) U7.3(DIN)
TRST: JP11.1 R8.2 U1.10(!TRST)
TXD: IC1.1(TXD) JP4.3 U1.40(GPIO28/SCIRXDA/SDAA/!TZ2)
TXD1: JP4.4
U1: JP12.11 R176.1
U2: JP12.3 R175.1
USBDM: C43.2 IC1.16(USBDM) R19.2
USBDP: C2.2 IC1.15(USBDP) R20.2
VBUS: C4.1 C5.1 F2.2 IC1.20(VCC) JP6.1
VBUS_ORG: C3.1 CON1.1 F2.1
VCC [power]: JP1.1
VCCIO: IC1.4(VCCIO) JP1.2 JP2.2 R2.2 R3.2
VDDIO: C14.1 C15.1 C16.1 C17.2 C18.2 C19.2 R12.1 R18.1 R195.1 SV2.5 U1.4(VDDIO_2) U1.11(VDDIO_3) U1.30(VDDIO_4) U1.49(VDDIO_5) U1.63(VDDIO_6) U1.74(VDDIO)
VIN1: C37.1 IC23.1(A:OUT) JP15.1 R141.2 R247.1
VIN1_INV: IC22.14(D:OUT) R150.2 U6.10(COM2) U6.11(NO3)
VIN1_SW: JP12.12 R149.1 U6.6(COM0) U6.7(NO1)
VIN2: C38.1 IC23.7(B:OUT) JP15.3 R140.2 R229.1
VIN2_INV: IC22.8(C:OUT) R138.2 U7.6(COM0) U7.7(NO1)
VIN2_SW: JP12.4 R137.1 U7.10(COM2) U7.11(NO3)
VIN3: C36.1 IC23.8(C:OUT) JP15.5 R139.2 R211.1
VIN4: C35.1 IC23.14(D:OUT) JP15.7 R142.2 R202.1
VIN5: C41.1 IC24.1(A:OUT) JP15.2 R26.1 R159.2
VIN6: C42.1 IC24.7(B:OUT) JP15.4 R1.1 R158.2
VIN7: C40.1 IC24.8(C:OUT) JP15.6 R157.2 R220.1
VIN8: C39.1 IC24.14(D:OUT) JP15.8 R160.2 R238.1
VIN+: D1.A JP13.1
VIN-: D3.C JP17.1
Unconnected: CON1.4 IC1.6(!RI) IC1.9(!DSR) IC1.10(!DCD) IC1.11(!CTS) IC1.13(CBUS2) IC1.27(OSCI) IC1.28(OSCO) IC18.8(C:OUT) IC18.9(C:-IN) IC18.10(C:+IN) IC19.8(C:OUT) IC19.9(C:-IN) IC19.10(C:+IN) IC20.8(C:OUT) IC20.9(C:-IN) IC20.10(C:+IN) IC21.8(C:OUT) IC21.9(C:-IN) IC21.10(C:+IN) JP4.9 JP4.10 JP4.12 JP8.2 JP12.7 JP12.8 JP15.9 JP15.10 JP15.11 JP15.12 JP15.13 JP15.14 JP18.1 JP18.3 JP18.5 JP18.7 JP18.9 JP18.11 JP18.13 JP18.15 SV2.6 U1.1(GPIO23/EQEP1I/MFSXA/SCIRXDB) U1.5(GPIO20/EQEP1A/MDXA/COMP1OUT) U1.6(GPIO21/EQEP1B/MDRA/COMP2OUT) U1.7(GPIO4/EPWM3A) U1.32(GPIO31/CANTXA/EPWM8A) U1.33(GPIO30/CANRXA/EPWM7A) U1.35(GPIO12/!TZ1/SCITXDA/SPISIMOB) U1.36(TEST2) U1.39(GPIO9/EPWM5B/SCITXDB/ECAP3) U1.42(GPIO17/SPISOMIA/!TZ3) U1.43(GPIO8/EPWM5A/!ADCSOCAO) U1.44(GPIO16/SPISIMOA/!TZ2) U1.45(GPIO7/EPWM4B/SCIRXDA/ECAP2) U1.46(GPIO6/EPWM4A/EPWMSYNCI/EPWMSYNCO) U1.53(GPIO39) U1.59(GPIO11/EPWM6B/SCIRXDB/ECAP1) U1.60(GPIO10/EPWM6A/!ADCSOCBO) U1.61(GPIO27/HRCAP2/!SPISTEB/USB0DM) U1.67(GPIO2/EPWM2A) U1.68(GPIO1/EPWM1B/COMP1OUT) U1.69(GPIO0/EPWM1A) U1.75(GPIO13/!TZ2/SPISOMIB) U1.76(GPIO14/!TZ3/SCITXDB/SPICLKB) U1.78(GPIO22/EQEP1S/MCLKXA/SCITXDB) U1.79(GPIO32/SDAA/EPWMSYNCI/!ADCSOCAO) U1.80(GPIO33/SCLA/EPWMSYNCO/!ADCSOCBO)

## Notes on the sheet
- Mini USB

## Library data of the parts
C1-C5 C22-C31 C43 = SparkFun-Capacitors:1.0UF: 1µF ceramic capacitors A capacitor is a passive two-terminal electrical component used to store electrical energy temporarily in an electric field.; PROD_ID: CAP-09822
C7-C21 = SparkFun-Capacitors:2.2UF: 2.2µF ceramic capacitors A capacitor is a passive two-terminal electrical component used to store electrical energy temporarily in an electric field.; PROD_ID: CAP-10009
C35-C42 = rcl:C-US: CAPACITOR, American symbol; SPICEPREFIX: C
CON1 = con-cypressindustries:MINI-USB-: MINI USB-B Conector Source: www.cypressindustries.com; OC_FARNELL: unknown; OC_NEWARK: unknown
D1 D3 = diode:1N4004: DIODE general purpose rectifier, 1 A
F2 = SparkFun:PTC: Resettable Fuse PTC Resettable Fuse. Spark Fun Electronics SKU : COM-08357
IC1 = ftdichip:FT232R: Source: http://www.ftdichip.com/Documents/DataSheets/DS_FT232R_v104.pdf; MPN: FT232RL; OC_FARNELL: 1146032; OC_NEWARK: 91K9918
IC3 IC30 = linear:TL084: OP AMP; SPICEPREFIX: B
IC4 = texas:TPS773*: 250-mA LDO REGULATORS WITH RESET OUTPUT Source: (TPS773) <http://www.ti.com/lit/ds/symlink/tps773.pdf>; MF: TEXAS INSTRUMENTS; MPN: TPS77333DGK; OC_FARNELL: 1510195; OC_NEWARK: 02M1919
IC5 IC14-IC29 = linear:TL084: OP AMP
IC6 = linear:78*: Positive VOLTAGE REGULATOR Source: http://cache.national.com/ds/LM/LM78L05.pdf http://www.fairchildsemi.com/ds/LM/LM7805.pdf
IC7 = linear:79*: Negative VOLTAGE REGULATOR
JP1 JP2 = jumper:JP2E: JUMPER
JP3 JP5-JP8 JP10 JP11 JP13 JP17 = pinhead:PINHD-1X2: PIN HEADER
JP4 = jumper:JP6Q: JUMPER
JP9 JP12 JP15 = jumper:JP7Q: JUMPER
JP16 JP18 = pinhead:PINHD-2X8: PIN HEADER
JP19-JP22 JP24 JP25 = jumper:JP4E: JUMPER
LED1 LED2 LED4-LED6 = led:LED: LED OSRAM: - CHIPLED LG R971, LG N971, LY N971, LG Q971, LY Q971, LO R971, LY R971 LH N974, LH R974 LS Q976, LO Q976, LY Q976 LO Q996 - Hyper CHIPLED LW Q18S LB Q993, LB Q99A, LB R99A - SideLED LS A670, LO A670, LY A670, LG A670, LP A670 LB A673, LV A673, LT A673, LW A673 LH A674 LY A675 LS A676, LA A676, LO A676, LY A676, LW A676 LS A679, LY A679, LG A679 - Hyper Micro SIDELED® LS Y876, LA Y876, LO Y876, LY Y876 LT Y87S - SmartLED LW L88C, LW L88S LB L89C, LB L89S, LG L890 LS L89K, LO L89K, LY L89K LS L896, LA L896, LO L896, LY L896 - TOPLED LS T670, LO T670, LY T670, LG T670, LP T670 LSG T670, LSP T670, LSY T670, LOP T670, LYG T670 LG T671, LOG T671, LSG T671 LB T673, LV T673, LT T673, LW T673 LH T674 LS T676, LA T676, LO T676, LY T676, LB T676, LH T676, LSB T676, LW T676 LB T67C, LV T67C, LT T67C, LS T67K, LO T67K, LY T67K, LW E67C LS E67B, LA E67B, LO E67B, LY E67B, LB E67C, LV E67C, LT E67C LW T67C LS T679, LY T679, LG T679 LS T770, LO T770, LY T770, LG T770, LP T770 LB T773, LV T773, LT T773, LW T773 LH T774 LS E675, LA E675, LY E675, LS T675 LS T776, LA T776, LO T776, LY T776, LB T776 LHGB T686 LT T68C, LB T68C - Hyper Mini TOPLED® LB M676 - Mini TOPLED Santana® LG M470 LS M47K, LO M47K, LY M47K Source: http://www.osram.convergy.de LUXEON: - LUMILED® LXK2-PW12-R00, LXK2-PW12-S00, LXK2-PW14-U00, LXK2-PW14-V00 LXK2-PM12-R00, LXK2-PM12-S00, LXK2-PM14-U00 LXK2-PE12-Q00, LXK2-PE12-R00, LXK2-PE12-S00, LXK2-PE14-T00, LXK2-PE14-U00 LXK2-PB12-K00, LXK2-PB12-L00, LXK2-PB12-M00, LXK2-PB14-N00, LXK2-PB14-P00, LXK2-PB14-Q00 LXK2-PR12-L00, LXK2-PR12-M00, LXK2-PR14-Q00, LXK2-PR14-R00 LXK2-PD12-Q00, LXK2-PD12-R00, LXK2-PD12-S00 LXK2-PH12-R00, LXK2-PH12-S00 LXK2-PL12-P00, LXK2-PL12-Q00, LXK2-PL12-R00 Source: www.luxeon.com KINGBRIGHT: KA-3528ASYC Source: www.kingbright.com
Q1 = transistor-pnp:BC558*: PNP Transistror
R1 R5 R6 R8-R11 R13-R17 R21-R23 R26-R34 R89-R194 R197-R255 = rcl:R-US_: RESISTOR, American symbol; SPICEPREFIX: R
R2-R4 R12 R18 = rcl:R-EU_: RESISTOR, European symbol
R7 R195 R196 = SparkFun-Resistors:RESISTOR: Generic Resistor Package
R19 R20 = rcl:R-US_: RESISTOR, American symbol
R24 = adafruit:R-US_: RESISTOR, American symbol
S2 = switch:FSMJSMA
SV2 = con-lstb:MA07-2: PIN HEADER; OC_FARNELL: unknown; OC_NEWARK: unknown
U1 = tmsProc69:TMS320F28069_PN_80; MANUFACTURER_PART_NUMBER: TMS320F28069_PN_80; VENDOR: Texas Instruments
U3 = tlv5610a:TLV5610_DW_20; MANUFACTURER_PART_NUMBER: TLV5610_DW_20; VENDOR: Texas Instruments
U4 U6 U7 = max395:MAX395EWG; MANUFACTURER_PART_NUMBER: max395ewg; VENDOR: Maxim Integrated Products
Y1 = SparkFun-Clocks:CRYSTAL: Crystals (Generic) These are passive quartz crystals, which can be used as a clock source for a microcontroller. Crystal's are two-terminal devices. They require external "load" capacitors to generate an oscillating signal.

## Net classes
0 default: width 0.203 mm
1 power: width 0.254 mm